# Altium project optical_sensor_v1.1.PrjPcb
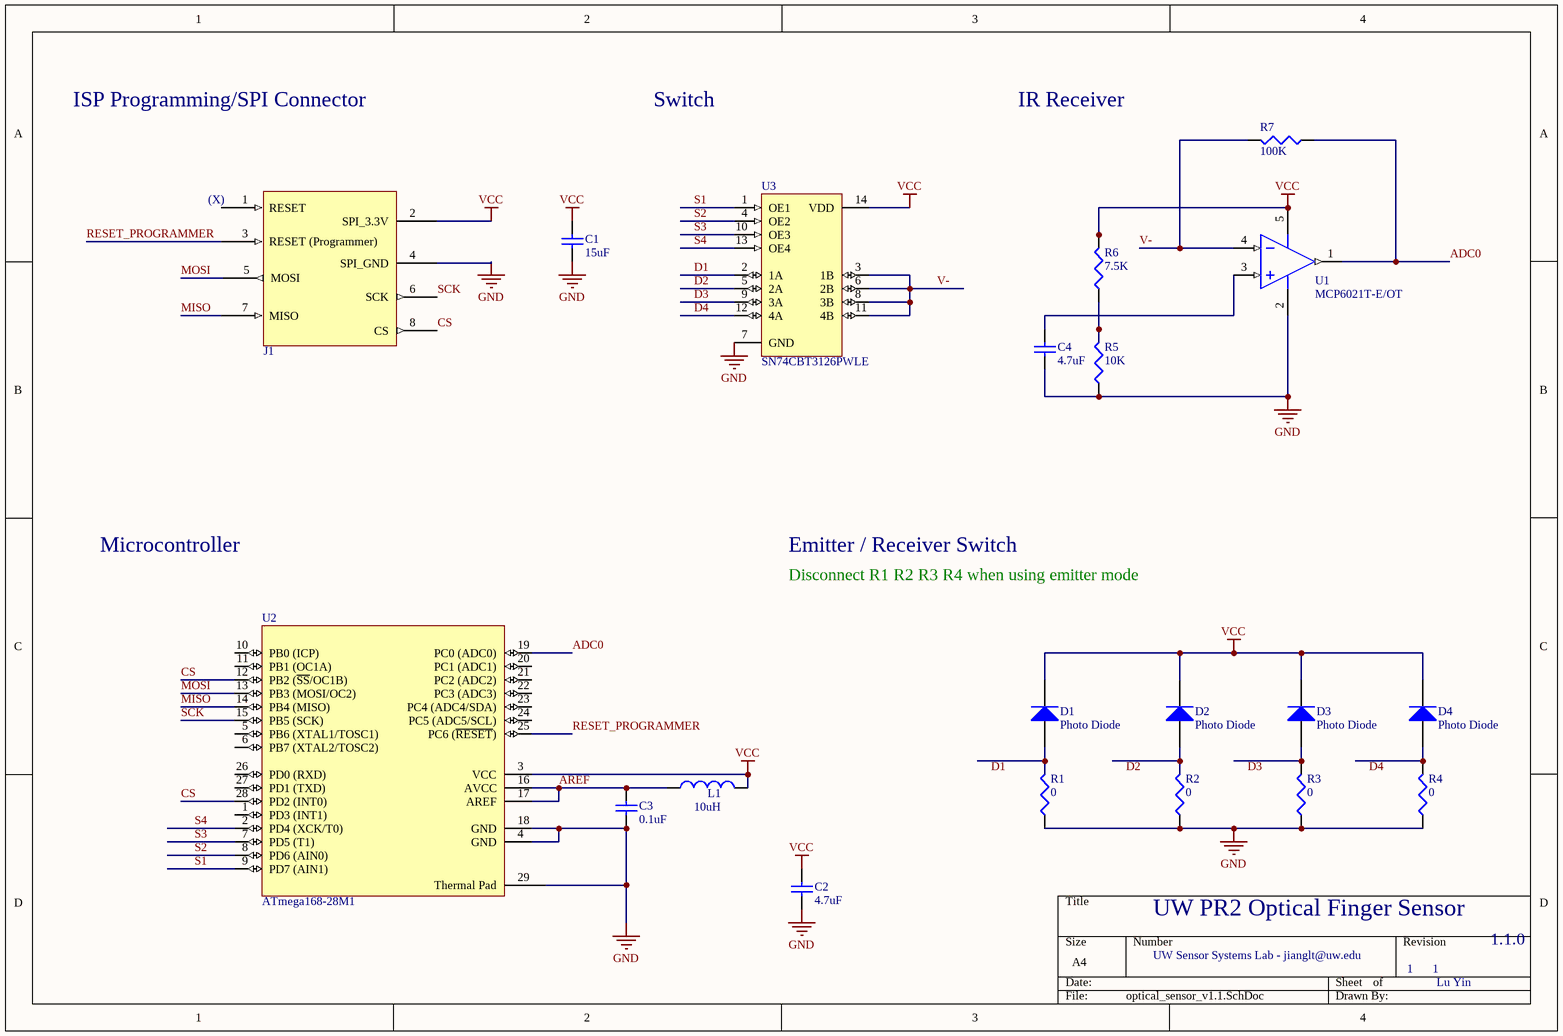
[diagram p0: optical_sensor_v1.1.SchDoc]
1 sheet, 20 parts. Net scope: global (net labels, ports and power ports of the same name join across sheets).
Board file: optical_sensor_v1.1.PcbDoc

## Sheet optical_sensor_v1.1.SchDoc
size A4

### Parts
C1  value 15uF  [CAPC1608N]  (hidden comment: Cap Semi)
C2  value 4.7uF  [CAPC1608N]  (hidden comment: Cap Semi)
C3  value 0.1uF  [CAPC1608N]  (hidden comment: BypassCap)
C4  value 4.7uF  [CAPC1608N]  (hidden comment: Cap Semi)
D1  Photo Diode  [Vishay VEMD/VSMB footprint]
D2  Photo Diode  [Vishay VEMD/VSMB footprint]
D3  Photo Diode  [Vishay VEMD/VSMB footprint]
D4  Photo Diode  [Vishay VEMD/VSMB footprint]
J1  FFC 8-PIN Connector (1mm)  [Hirose FFC connector 8-Pin]  (value not drawn)
L1  value 10uH  [INDC1608N]  (hidden comment: Inductor)
R1  value 0  [RESC1608N]  (hidden comment: Rlevel)
R2  value 0  [RESC1608N]  (hidden comment: Rlevel)
R3  value 0  [RESC1608N]  (hidden comment: Rlevel)
R4  value 0  [RESC1608N]  (hidden comment: Rlevel)
R5  value 10K  [RESC1608N]  (hidden comment: Rlevel)
R6  value 7.5K  [RESC1608N]  (hidden comment: Rlevel)
R7  value 100K  [RESC1608N]  (hidden comment: Rlevel)
U1  MCP6021T-E/OT  [SOT-23-OT5_N]
U2  ATmega168-28M1
U3  SN74CBT3126PWLE  [PW014_N]

### Nets
GND: C1.2 C2.2 C3.1 C4.2 J1.4(SPI_GND) R1.1 R2.1 R3.1 R4.1 R5.1 U1.2(VSS) U2.4(GND) U2.18(GND) U2.29(Thermal_Pad) U3.7(GND)
VCC: C1.1 C2.1 D1.2(K) D2.2(K) D3.2(K) D4.2(K) J1.2(SPI_3.3V) L1.2 R6.2 U1.5(VDD) U2.3(VCC) U3.14(VDD)
ADC0: R7.1 U1.1(VOUT) U2.19(PC0_(ADC0))
AREF: C3.2 L1.1 U2.16(AVCC) U2.17(AREF)
CS: J1.8(CS) U2.12(PB2_(~{SS}/OC1B)) U2.28(PD2_(INT0))
D1: U3.2(1A)
D2: U3.5(2A)
D3: U3.9(3A)
D4: U3.12(4A)
MISO: J1.7(MISO) U2.14(PB4_(MISO))
MOSI: J1.5(MOSI) U2.13(PB3_(MOSI/OC2))
RESET_PROGRAMMER: J1.3(RESET_(Programmer)) U2.25(PC6_(~{RESET}))
S1: U2.9(PD7_(AIN1)) U3.1(OE1)
S2: U2.8(PD6_(AIN0)) U3.4(OE2)
S3: U2.7(PD5_(T1)) U3.10(OE3)
S4: U2.2(PD4_(XCK/T0)) U3.13(OE4)
SCK: J1.6(SCK) U2.15(PB5_(SCK))
V-: R7.2 U1.4(VIN-) U3.3(1B) U3.6(2B) U3.8(3B) U3.11(4B)
NetC4_1: C4.1 U1.3(VIN+)
NetD1_1: D1.1(A) R1.2
NetD2_1: D2.1(A) R2.2
NetD3_1: D3.1(A) R3.2
NetD4_1: D4.1(A) R4.2
NetR5_2: R5.2 R6.1

Not connected (* = marked no-connect by the designer): J1 1(RESET); U2 1(PD3_(INT1)) 5(PB6_(XTAL1/TOSC1)) 6(PB7_(XTAL2/TOSC2)) 10(PB0_(ICP)) 11(PB1_(OC1A)) 20(PC1_(ADC1)) 21(PC2_(ADC2)) 22(PC3_(ADC3)) 23(PC4_(ADC4/SDA)) 24(PC5_(ADC5/SCL)) 26(PD0_(RXD)) 27(PD1_(TXD))

### Notes on the sheet
- ISP Programming/SPI Connector
- Switch
- IR Receiver
- (near J1) (X)
- Microcontroller
- Emitter / Receiver Switch
- Disconnect R1 R2 R3 R4 when using emitter mode
- UW PR2 Optical Finger Sensor
- UW Sensor Systems Lab - jianglt@uw.edu
- 1
- Lu Yin
- 1.1.0
- Labels drawn without touching a wire or pin: D1, D2, D3, D4

### Library data of the parts
C1-C4 = Cap Semi: Capacitor (Semiconductor SIM Model); Published: 8-Jun-2000; LatestRevisionDate: 29-May-2009; LatestRevisionNote: IPC-7351 Footprint Added.; PackageReference: C1206; Publisher: Altium Limited; PackageDescription: Chip Capacitor
D1-D4 = Diode: Default Diode; Published: 8-Jun-2000; LatestRevisionDate: 17-Jul-2002; LatestRevisionNote: Re-released for DXP Platform.; PackageVersion: Sep-1996; PackageReference: SMC; Publisher: Altium Limited; PackageDescription: DO-214-AB/SMC; 2 C-Bend Leads; Body 7.9 x 5.9 mm, inc. leads (LxW); Code_JEDEC: DO-214-AB
J1 = FFC Connector-8Pin-SMT-1mm: FFC 8-PIN Connector (1mm) (SMT)
L1 = Inductor: Code_IEC: 1005; Published: 8-Jun-2000; LatestRevisionDate: 29-May-2009; LatestRevisionNote: IPC-7351 Footprint Added.; PackageReference: 0402-A; Publisher: Altium Limited; PackageDescription: Chip Inductor; Code_JEITA: 0402
R1-R7 = Res3: Resistor; Published: 8-Jun-2000; LatestRevisionDate: 29-May-2009; LatestRevisionNote: IPC-7351 Footprint Added.; PackageReference: J1-0603; Publisher: Altium Limited; PackageDescription: Chip Resistor
U1 = MCP6021T-E/OT: Rail-to-Rail Input/Output, 10 MHz Operational Amplifier, 5-Pin SOT-23, Extended Temperature, Tape and Reel; Published: 29-Jan-2009; LatestRevisionDate: 02-Dec-2009; LatestRevisionNote: Updated to datasheet revision D, Feb-2009; DatasheetVersion: revD, Feb-2009; PackageVersion: revBB, Aug-2009; PackageReference: SOT-23-OT5; Publisher: Altium Limited; PackageDescription: 5-Lead Plastic Small Outline Transistor (OT) [SOT-23]; Supplier 1: Digi-Key; Supplier Part Number 1: MCP6021T-E/OTTR-ND; Supplier 2: Digi-Key; Supplier Part Number 2: MCP6021T-E/OTCT-ND; Supplier 3: Digi-Key; Supplier Part Number 3: MCP6021T-E/OTDKR-ND; Supplier 4: Farnell; Supplier Part Number 4: 1605573; Code_IPC: SOT23-5; ComponentLink1Description: Datasheet; ComponentLink1URL: http://ww1.microchip.com/downloads/en/DeviceDoc/21685d.pdf; ComponentLink2Description: Packaging Specification; ComponentLink2URL: http://www.microchip.com/stellent/groups/techpub_sg/documents/packagingspec/en012702.pdf; ComponentLink3Description: Microchip.com Home; ComponentLink3URL: http://www.microchip.com/
U2 = ATmega168-28M1: 8-Bit AVR Microcontroller with 8K Bytes of In-System Programmable Flash Memory; Published: 17-Sep-2003; LatestRevisionDate: 04-Mar-2005; LatestRevisionNote: Stylized 3D Model Added.; DatasheetVersion: 2486H-AVR-09/02; PackageVersion: revB, Sep-2001; PackageReference: 28P3; Publisher: Altium Limited; PackageDescription: DIP; 28 Leads; Row Spacing 7.62 mm; Pitch 2.54 mm; ComponentLink1Description: Manufacturer Link; ComponentLink1URL: http://www.atmel.com; ComponentLink2Description: Datasheet; ComponentLink2URL: http://www.atmel.com/dyn/resources/prod_documents/doc2486.pdf
U3 = SN74CBT3126PWLE: Quadruple FET Bus Switch; Published: 8-Jun-2000; LatestRevisionDate: 16-Oct-2006; LatestRevisionNote: IPC-7351 Footprint Added.; DatasheetVersion: May-1998; PackageVersion: Feb-1999; PackageReference: PW014; Publisher: Altium Limited; PackageDescription: 14-Pin Thin Small Outline Package 0.65 mm Pitch; ComponentLink1Description: Manufacturer Link; ComponentLink1URL: http://www.ti.com/; ComponentLink2Description: Datasheet; ComponentLink2URL: http://www-s.ti.com/sc/ds/sn74cbt3126.pdf